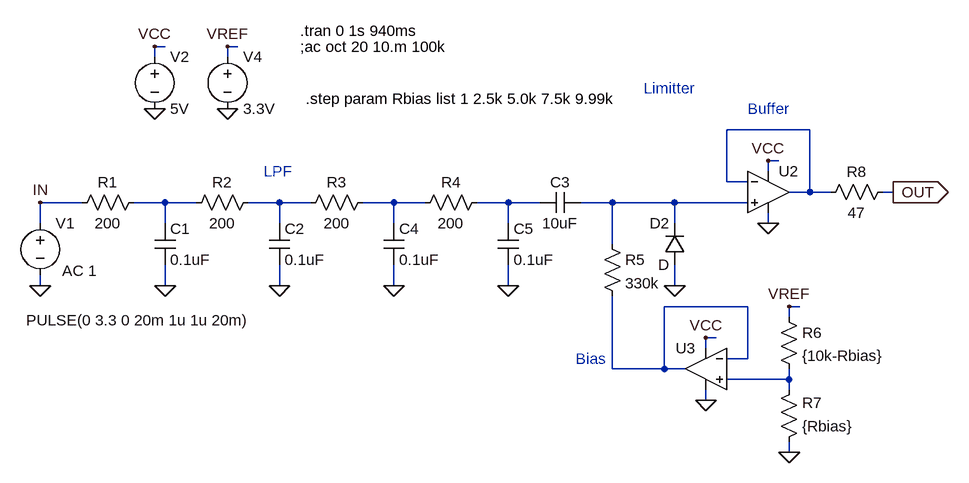
[diagram p0: schematic ArduinoLFO_Ouput_Board_NoInputBuffer_NoLimitter.asc]
ArduinoLFO_Ouput_Board_NoInputBuffer_NoLimitter.asc, the LTspice schematic file:
Version 4
SHEET 1 1556 680
WIRE 208 -160 192 -160
WIRE 320 -160 304 -160
WIRE 192 -144 192 -160
WIRE 304 -144 304 -160
WIRE 1200 -32 1072 -32
WIRE 1152 16 1136 16
WIRE 1136 32 1136 16
WIRE 1072 48 1072 -32
WIRE 1104 48 1072 48
WIRE 1200 64 1200 -32
WIRE 1200 64 1168 64
WIRE 1232 64 1200 64
WIRE 1328 64 1312 64
WIRE 80 80 16 80
WIRE 208 80 160 80
WIRE 256 80 208 80
WIRE 384 80 336 80
WIRE 432 80 384 80
WIRE 560 80 512 80
WIRE 608 80 560 80
WIRE 736 80 688 80
WIRE 784 80 736 80
WIRE 896 80 848 80
WIRE 992 80 896 80
WIRE 1104 80 992 80
WIRE 16 112 16 80
WIRE 208 112 208 80
WIRE 384 112 384 80
WIRE 560 112 560 80
WIRE 736 112 736 80
WIRE 992 112 992 80
WIRE 1136 112 1136 96
WIRE 896 144 896 80
WIRE 16 208 16 192
WIRE 208 208 208 176
WIRE 384 208 384 176
WIRE 560 208 560 176
WIRE 736 208 736 176
WIRE 992 208 992 176
WIRE 1104 240 976 240
WIRE 1184 240 1168 240
WIRE 1168 256 1168 240
WIRE 1056 288 1040 288
WIRE 1040 304 1040 288
WIRE 1104 320 1104 240
WIRE 1104 320 1072 320
WIRE 896 336 896 224
WIRE 976 336 976 240
WIRE 976 336 896 336
WIRE 1008 336 976 336
WIRE 1168 352 1168 336
WIRE 1168 352 1072 352
WIRE 1168 368 1168 352
WIRE 1040 384 1040 368
WIRE 1168 464 1168 448
FLAG 16 208 0
FLAG 16 80 IN
FLAG 208 208 0
FLAG 1328 64 OUT
IOPIN 1328 64 Out
FLAG 384 208 0
FLAG 192 -64 0
FLAG 192 -160 VCC
FLAG 1136 16 VCC
FLAG 1136 112 0
FLAG 304 -64 0
FLAG 304 -160 VREF
FLAG 1040 288 VCC
FLAG 1040 384 0
FLAG 1168 464 0
FLAG 1168 240 VREF
FLAG 992 208 0
FLAG 560 208 0
FLAG 736 208 0
SYMBOL voltage 16 96 R0
WINDOW 3 -22 165 Left 2
WINDOW 123 34 89 Left 2
WINDOW 39 0 0 Left 2
SYMATTR Value PULSE(0 3.3 0 20m 1u 1u 20m)
SYMATTR Value2 AC 1
SYMATTR InstName V1
SYMBOL cap 192 112 R0
SYMATTR InstName C1
SYMATTR Value 0.1uF
SYMBOL res 176 64 R90
WINDOW 0 0 56 VBottom 2
WINDOW 3 32 56 VTop 2
SYMATTR InstName R1
SYMATTR Value 200
SYMBOL cap 368 112 R0
SYMATTR InstName C2
SYMATTR Value 0.1uF
SYMBOL res 352 64 R90
WINDOW 0 0 56 VBottom 2
WINDOW 3 32 56 VTop 2
SYMATTR InstName R2
SYMATTR Value 200
SYMBOL voltage 192 -160 R0
SYMATTR InstName V2
SYMATTR Value 5V
SYMBOL res 880 128 R0
SYMATTR InstName R5
SYMATTR Value 330k
SYMBOL cap 848 64 R90
WINDOW 0 0 32 VBottom 2
WINDOW 3 32 32 VTop 2
SYMATTR InstName C3
SYMATTR Value 10uF
SYMBOL Opamps\\UniversalOpamp2 1136 64 R0
SYMATTR InstName U2
SYMBOL voltage 304 -160 R0
SYMATTR InstName V4
SYMATTR Value 3.3V
SYMBOL Opamps\\UniversalOpamp2 1040 336 M0
SYMATTR InstName U3
SYMBOL res 1152 240 R0
SYMATTR InstName R6
SYMATTR Value {10k-Rbias}
SYMBOL res 1152 464 M180
WINDOW 0 36 76 Left 2
WINDOW 3 36 40 Left 2
SYMATTR InstName R7
SYMATTR Value {Rbias}
SYMBOL res 1328 48 R90
WINDOW 0 0 56 VBottom 2
WINDOW 3 32 56 VTop 2
SYMATTR InstName R8
SYMATTR Value 47
SYMBOL diode 1008 176 R180
WINDOW 0 24 64 Left 2
WINDOW 3 24 0 Left 2
SYMATTR InstName D2
SYMBOL cap 544 112 R0
SYMATTR InstName C4
SYMATTR Value 0.1uF
SYMBOL cap 720 112 R0
SYMATTR InstName C5
SYMATTR Value 0.1uF
SYMBOL res 704 64 R90
WINDOW 0 0 56 VBottom 2
WINDOW 3 32 56 VTop 2
SYMATTR InstName R4
SYMATTR Value 200
SYMBOL res 528 64 R90
WINDOW 0 0 56 VBottom 2
WINDOW 3 32 56 VTop 2
SYMATTR InstName R3
SYMATTR Value 200
TEXT 416 -184 Left 2 !.tran 0 1s 940ms
TEXT 416 -160 Left 2 !;ac oct 20 10.m 100k
TEXT 424 -80 Left 2 !.step param Rbias list 1 2.5k 5.0k 7.5k 9.99k
TEXT 944 -96 Left 2 ;Limitter
TEXT 840 320 Left 2 ;Bias
TEXT 1104 -64 Left 2 ;Buffer
TEXT 360 32 Left 2 ;LPF

The netlist it stands for:
* ArduinoLFO_Ouput_Board_NoInputBuffer_NoLimitter.asc
V1 IN 0 PULSE(0 3.3 0 20m 1u 1u 20m) AC 1
C1 N002 0 0.1uF
R1 N002 IN 200
C2 N003 0 0.1uF
R2 N003 N002 200
V2 VCC 0 5V
R5 N006 N007 330k
C3 N006 N005 10uF
XU2 N006 N001 VCC 0 N001 level.2 Avol=1Meg GBW=10Meg Slew=10Meg ilimit=25m rail=0 Vos=0 phimargin=45 en=0 enk=0 in=0 ink=0 Rin=500Meg  ; pins IN+ IN- V+ V- OUT
V4 VREF 0 3.3V
XU3 N008 N007 VCC 0 N007 level.2 Avol=1Meg GBW=10Meg Slew=10Meg ilimit=25m rail=0 Vos=0 phimargin=45 en=0 enk=0 in=0 ink=0 Rin=500Meg  ; pins IN+ IN- V+ V- OUT
R6 VREF N008 {10k-Rbias}
R7 0 N008 {Rbias}
R8 OUT N001 47
D2 0 N006 D
C4 N004 0 0.1uF
C5 N005 0 0.1uF
R4 N005 N004 200
R3 N004 N003 200
.model D D
.lib standard.dio
.tran 0 1s 940ms
;ac oct 20 10.m 100k
.step param Rbias list 1 2.5k 5.0k 7.5k 9.99k
* Limitter
* Bias
* Buffer
* LPF
.lib UniversalOpamps2.sub
.backanno
.end